# Altium schematic sheet PSU.SchDoc: Project Title
size A3; ApprovedBy: Yves Chevallier; CheckedBy: Yves Chevallier; Author: Yves Chevallier; CompanyName: EPFL; DrawnBy: Yves Chevallier; Engineer: Yves Chevallier; Organization: EPFL; Address1: EPFL; Address2: CH1015 Lausanne; Address3: +41(0)21 693 36 98; Address4: +41(0)21 693 26 00; DocumentNumber: ABC.00.0000.000.0; Revision: v1.0; SheetNumber: 0; SheetTotal: 0; DrawnByDate: 2000-01-01; ExecutionWarrantDate: 2000-01-01; ExecutionWarrant: Yves Chevallier; Context: Confidential; PageSetup: Record=PageOptions|CenterHorizontal=True|CenterVertical=False|PrintScale=0.97|XCorrection=1.00|YCorrection=1.00|PrintKind=0|BorderSize=5000000|LeftOffset=0|BottomOffset=0|Orientation=2|PaperLength=1000|PaperWidth=1000|Scale=100|PaperSource=262|PrintQuality=600|MediaType=1|DitherType=10|PaperKind=A4|PrintScaleMode=1; EngineerDate: 2000-01-01; CheckedByDate: 2000-01-01; ProjectName: PRJ
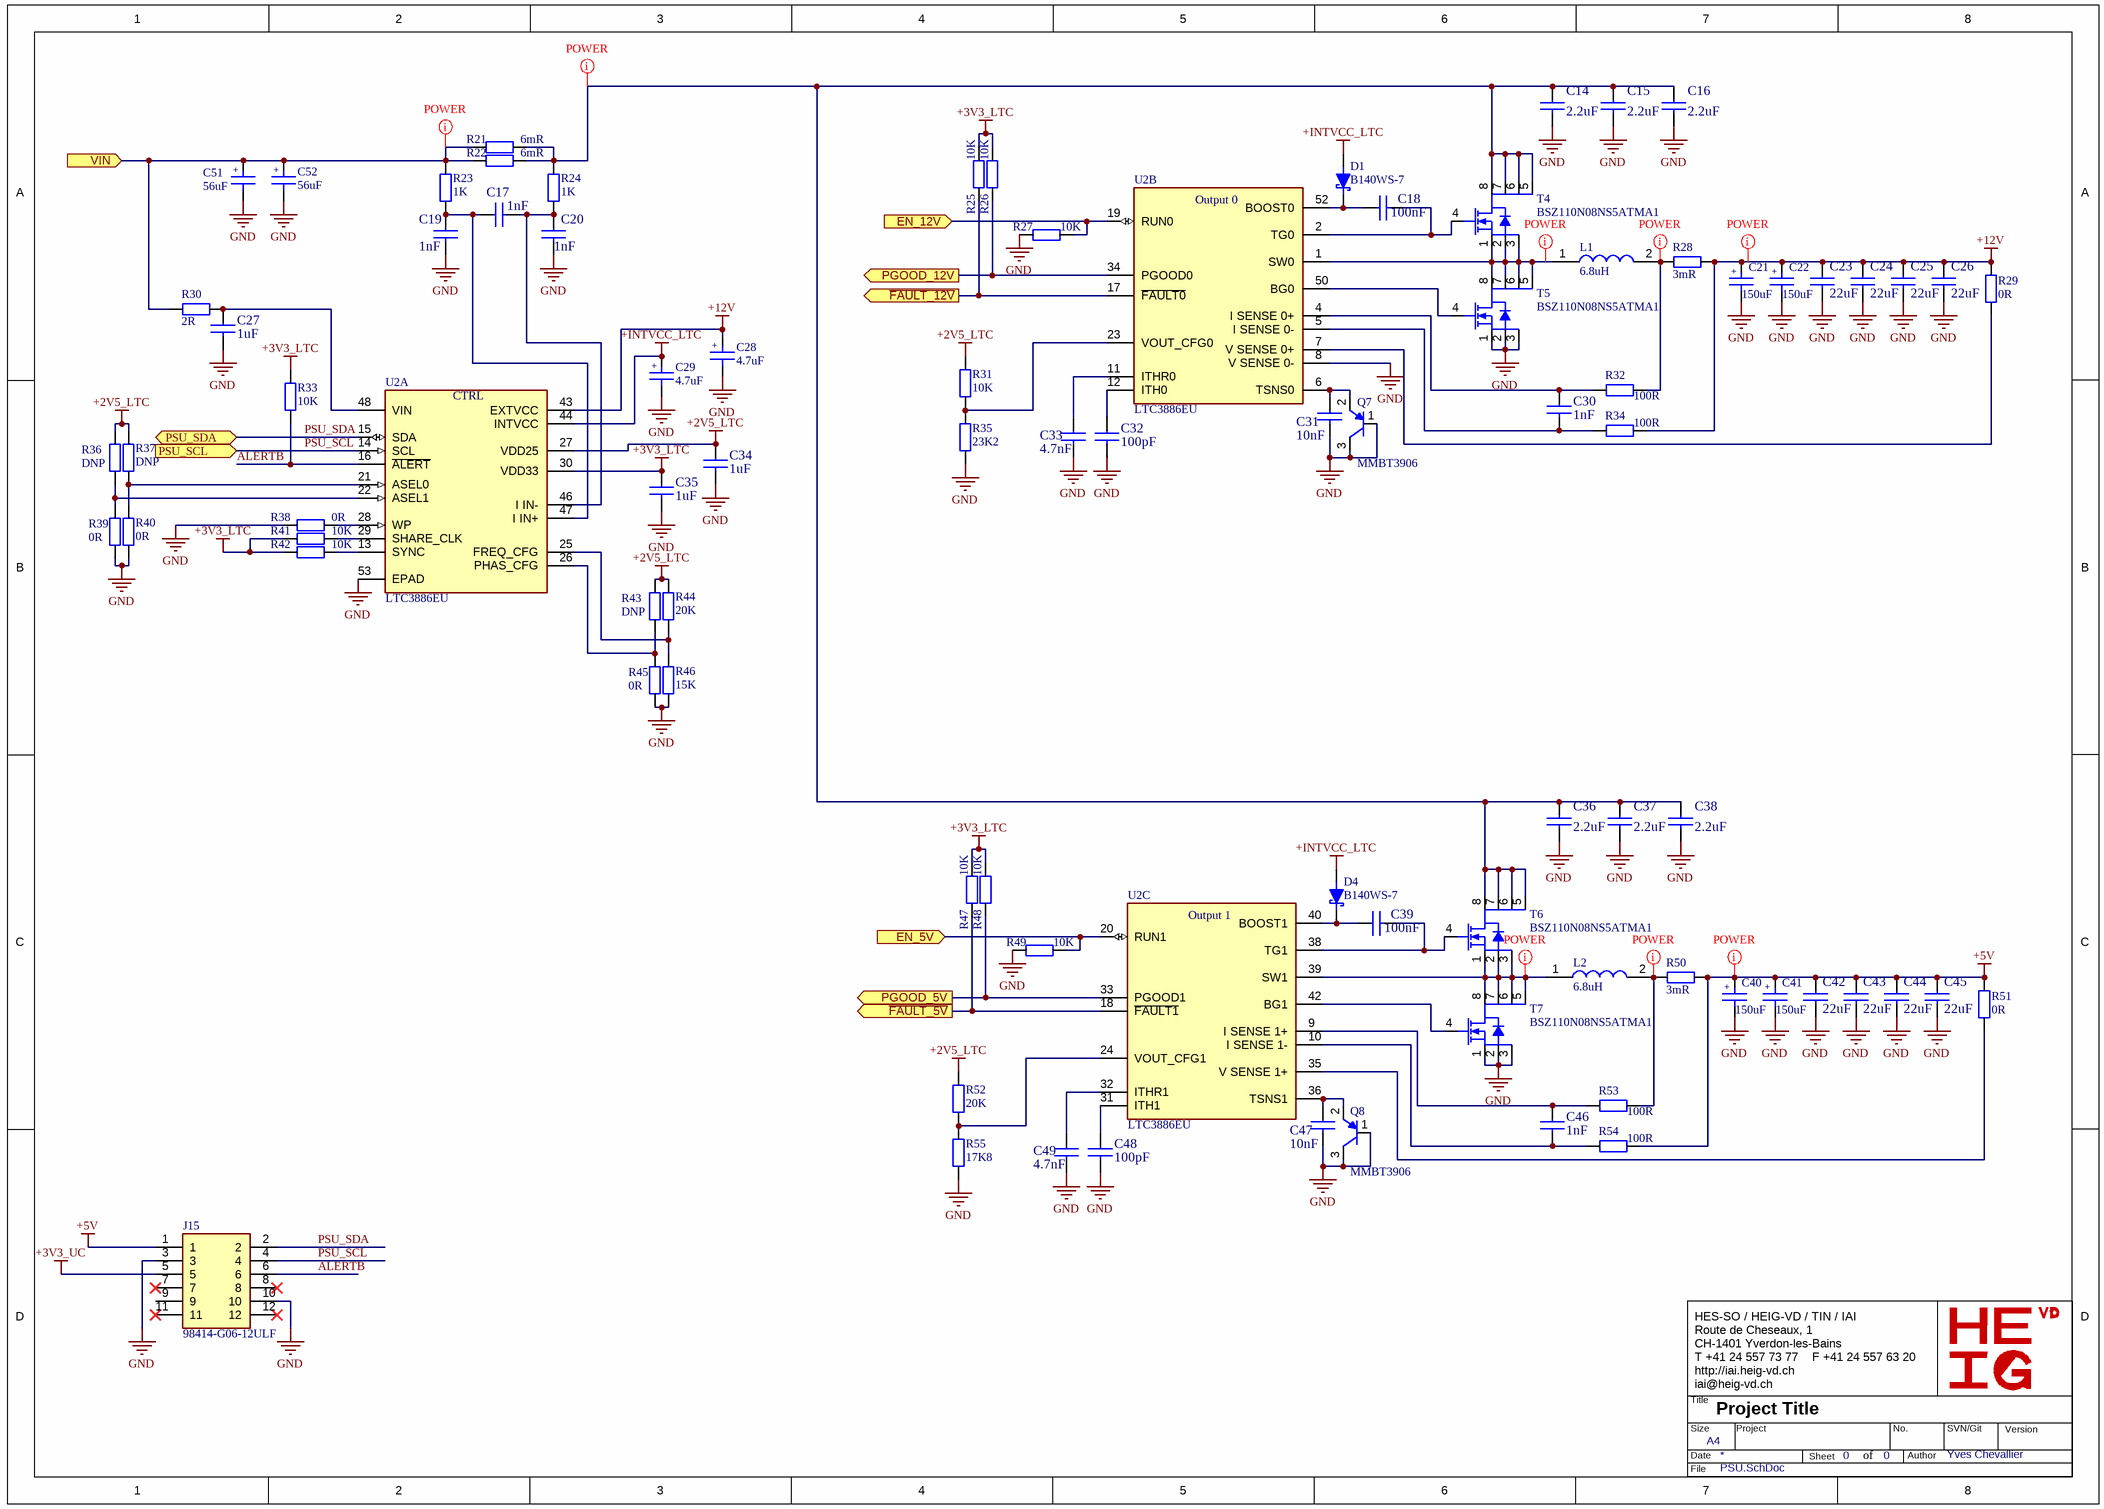
[diagram p0: PSU.SchDoc]

## Parts
C14  2.2uF  [SM/C_0805]
C15  2.2uF  [SM/C_0805]
C16  2.2uF  [SM/C_0805]
C17  1nF  [SM/C_0603]
C18  100nF  [SM/C_0603]
C19  1nF  [SM/C_0603]
C20  1nF  [SM/C_0603]
C21  150uF  [SM/CT_7343_12_D]
C22  150uF  [SM/CT_7343_12_D]
C23  22uF  [SM/C_1210]
C24  22uF  [SM/C_1210]
C25  22uF  [SM/C_1210]
C26  22uF  [SM/C_1210]
C27  1uF  [SM/C_0805]
C28  4.7uF  [T_CAPMP3216X180N]
C29  4.7uF  [T_CAPMP3216X180N]
C30  1nF  [SM/C_0603]
C31  10nF  [SM/C_0603]
C32  100pF  [SM/C_0603]
C33  4.7nF  [SM/C_0603]
C34  1uF  [SM/C_0603]
C35  1uF  [SM/C_0603]
C36  2.2uF  [SM/C_0805]
C37  2.2uF  [SM/C_0805]
C38  2.2uF  [SM/C_0805]
C39  100nF  [SM/C_0603]
C40  150uF  [SM/CT_7343_12_D]
C41  150uF  [SM/CT_7343_12_D]
C42  22uF  [SM/C_1210]
C43  22uF  [SM/C_1210]
C44  22uF  [SM/C_1210]
C45  22uF  [SM/C_1210]
C46  1nF  [SM/C_0603]
C47  10nF  [SM/C_0603]
C48  100pF  [SM/C_0603]
C49  4.7nF  [SM/C_0603]
C51  56uF  [SM/C SIZE F12]
C52  56uF  [SM/C SIZE F12]
D1  B140WS-7  [SM/D_SOD323_A1C2 (SC-76)]
D4  B140WS-7  [SM/D_SOD323_A1C2 (SC-76)]
J15  98414-G06-12ULF  [98414G0612ULF]
L1  6.8uH  [WE-HCI_189023]
L2  6.8uH  [WE-HCI_189023]
Q7  MMBT3906  [SOT23]
Q8  MMBT3906  [SOT23]
R21  6mR  [SM/R_2512]
R22  6mR  [SM/R_2512]
R23  1K  [SM/R_0603]
R24  1K  [SM/R_0603]
R25  10K  [SM/R_0603]
R26  10K  [SM/R_0603]
R27  10K  [SM/R_0603]
R28  3mR  [SM/R_1210]
R29  0R  [SM/R_0603]
R30  2R  [SM/R_0603]
R31  10K  [SM/R_0603]
R32  100R  [SM/R_0603]
R33  10K  [SM/R_0603]
R34  100R  [SM/R_0603]
R35  23K2  [SM/R_0603]
R36  DNP  [SM/R_0603]  (no BOM)
R37  DNP  [SM/R_0603]  (no BOM)
R38  0R  [SM/R_0603]
R39  0R  [SM/R_0603]
R40  0R  [SM/R_0603]
R41  10K  [SM/R_0603]
R42  10K  [SM/R_0603]
R43  DNP  [SM/R_0603]  (no BOM)
R44  20K  [SM/R_0603]
R45  0R  [SM/R_0603]
R46  15K  [SM/R_0603]
R47  10K  [SM/R_0603]
R48  10K  [SM/R_0603]
R49  10K  [SM/R_0603]
R50  3mR  [SM/R_1210]
R51  0R  [SM/R_0603]
R52  20K  [SM/R_0603]
R53  100R  [SM/R_0603]
R54  100R  [SM/R_0603]
R55  17K8  [SM/R_0603]
T4  BSZ110N08NS5ATMA1  [BSZ110N08NS5ATMA1]
T5  BSZ110N08NS5ATMA1  [BSZ110N08NS5ATMA1]
T6  BSZ110N08NS5ATMA1  [BSZ110N08NS5ATMA1]
T7  BSZ110N08NS5ATMA1  [BSZ110N08NS5ATMA1]
U2  LTC3886EU  [UKG_52_ADI]  (parts A,B,C of 3)

## Ports
EN_5V (in), EN_12V (in), PGOOD_5V (out), PGOOD_12V (out), PSU_SCL (in), PSU_SDA (bidir), VIN (in), ~{FAULT_5V} (out), ~{FAULT_12V} (out)

## Nets
+2V5_LTC: C34.1 R31.2 R36.2 R37.2 R43.2 R44.1 R52.1 U2.27(VDD25)
+3V3_LTC: C35.1 R25.1 R26.1 R33.2 R41.1 R42.1 R47.1 R48.1 U2.30(VDD33)
+3V3_UC: J15.5
+5V: C40.1 C41.1 C42.1 C43.1 C44.1 C45.1 J15.1 R50.2 R51.2 R54.2
+12V: C21.1 C22.1 C23.1 C24.1 C25.1 C26.1 C28.1 R28.2 R29.2 R34.2 U2.43(EXTVCC)
+INTVCC_LTC: C29.1 D1.1(A) D4.1(A) U2.44(INTVCC)
GND: C14.2 C15.2 C16.2 C19.2 C20.2 C21.2 C22.2 C23.2 C24.2 C25.2 C26.2 C27.2 C28.2 C29.2 C31.2 C32.2 C33.2 C34.2 C35.2 C36.2 C37.2 C38.2 C40.2 C41.2 C42.2 C43.2 C44.2 C45.2 C47.2 C48.2 C49.2 C51.2 C52.2 J15.3 J15.10 Q7.1(B) Q7.3(C) Q8.1(B) Q8.3(C) R27.2 R35.2 R38.2 R39.1 R40.1 R45.1 R46.2 R49.2 R55.2 T5.1(S) T5.2(S) T5.3(S) T7.1(S) T7.2(S) T7.3(S) U2.8(V_SENSE_0-) U2.53(EPAD)
~{FAULT_5V}: R47.2 U2.18(~{FAULT1}) ; port ~{FAULT_5V}
~{FAULT_12V}: R25.2 U2.17(~{FAULT0}) ; port ~{FAULT_12V}
ALERTB: J15.6 R33.1 U2.16(~{ALERT})
EN_5V: R49.1 U2.20(RUN1) ; port EN_5V
EN_12V: R27.1 U2.19(RUN0) ; port EN_12V
PGOOD_5V: R48.2 U2.33(PGOOD1) ; port PGOOD_5V
PGOOD_12V: R26.2 U2.34(PGOOD0) ; port PGOOD_12V
PSU_SCL: J15.4 U2.14(SCL) ; port PSU_SCL
PSU_SDA: J15.2 U2.15(SDA) ; port PSU_SDA
VIN: C51.1 C52.1 R21.1 R22.1 R23.1 R30.1 ; port VIN
NetC14_1: C14.1 C15.1 C16.1 C36.1 C37.1 C38.1 R21.2 R22.2 R24.1 T4.5(D) T4.6(D) T4.7(D) T4.8(D) T6.5(D) T6.6(D) T6.7(D) T6.8(D)
NetC17_1: C17.1 C19.1 R23.2 U2.47(I_IN+)
NetC17_2: C17.2 C20.1 R24.2 U2.46(I_IN-)
NetC18_1: C18.1 D1.2(C) U2.52(BOOST0)
NetC18_2: C18.2 T4.4(G) U2.2(TG0)
NetC27_1: C27.1 R30.2 U2.48(VIN)
NetC30_1: C30.1 R32.1 U2.4(I_SENSE_0+)
NetC30_2: C30.2 R34.1 U2.5(I_SENSE_0-)
NetC31_1: C31.1 Q7.2(E) U2.6(TSNS0)
NetC32_1: C32.1 U2.12(ITH0)
NetC33_1: C33.1 U2.11(ITHR0)
NetC39_1: C39.1 D4.2(C) U2.40(BOOST1)
NetC39_2: C39.2 T6.4(G) U2.38(TG1)
NetC46_1: C46.1 R53.1 U2.9(I_SENSE_1+)
NetC46_2: C46.2 R54.1 U2.10(I_SENSE_1-)
NetC47_1: C47.1 Q8.2(E) U2.36(TSNS1)
NetC48_1: C48.1 U2.31(ITH1)
NetC49_1: C49.1 U2.32(ITHR1)
NetL1_1: L1.1 T4.1(S) T4.2(S) T4.3(S) T5.5(D) T5.6(D) T5.7(D) T5.8(D) U2.1(SW0)
NetL1_2: L1.2 R28.1 R32.2
NetL2_1: L2.1 T6.1(S) T6.2(S) T6.3(S) T7.5(D) T7.6(D) T7.7(D) T7.8(D) U2.39(SW1)
NetL2_2: L2.2 R50.1 R53.2
NetR29_1: R29.1 U2.7(V_SENSE_0+)
NetR31_1: R31.1 R35.1 U2.23(VOUT_CFG0)
NetR36_1: R36.1 R39.2 U2.22(ASEL1)
NetR37_1: R37.1 R40.2 U2.21(ASEL0)
NetR38_1: R38.1 U2.28(WP)
NetR41_2: R41.2 U2.29(SHARE_CLK)
NetR42_2: R42.2 U2.13(SYNC)
NetR43_1: R43.1 R45.2 U2.26(PHAS_CFG)
NetR44_2: R44.2 R46.1 U2.25(FREQ_CFG)
NetR51_1: R51.1 U2.35(V_SENSE_1+)
NetR52_2: R52.2 R55.1 U2.24(VOUT_CFG1)
NetT5_4: T5.4(G) U2.50(BG0)
NetT7_4: T7.4(G) U2.42(BG1)

Not connected (* = marked no-connect by the designer): J15 7* 8* 9 11* 12*

## Layout directives
net class POWER_CLASS: +5V, +12V, NetC14_1, NetL1_1, NetL1_2, NetL2_1, NetL2_2, VIN

## Notes on the sheet
- HES-SO / HEIG-VD / TIN / IAI
  Route de Cheseaux, 1
  CH-1401 Yverdon-les-Bains
  T +41 24 557 73 77    F +41 24 557 63 20
  http://iai.heig-vd.ch
  iai@heig-vd.ch
- Title
- Size
- Date
- A4
- Project
- Sheet
- of
- No.
- Author
- SVN/Git
- Version
- File
- (in symbol C-TA-4.7uF-10V-20%-3216) +
- (in symbol CAP TANT 150UF 20% 25V 2924) +
- (in symbol HYBRID POLYMER, SMD, 63V, 56UF,) +
- (in symbol IC REG CTRLR BUCK PMBUS 52QFN, part A) CTRL
- (in symbol IC REG CTRLR BUCK PMBUS 52QFN, part B) Output 0
- (in symbol IC REG CTRLR BUCK PMBUS 52QFN, part C) Output 1

## Library data of the parts
C14-C16 C36-C38 = CAP CER 2.2UF 25V X5R 0805: Manufacturer: Samsung; Manufacturer P/N: CL21A225KAFNNNE; Tolerance: 10%; Supplier 1: Digikey; Supplier Part Number 2: 187-CL21A225KAFNNNE; Supplier 2: Mouser; Supplier Part Number 1: 1276-1763-1-ND; Value: 2.2uF; Voltage: 25V; Dielectric: X5R
C17 C19 C20 C30 C46 = CAP CER 1NF 50V X7R 0603: Manufacturer: Samsung; Manufacturer P/N: CL10B102KB8WPJC; Tolerance: 10%; Supplier 1: Digikey; Supplier Part Number 2: 187-CL10B102KB8WPJC; Supplier 2: Mouser; Supplier Part Number 1: 1276-CL10B102KB8WPJCCT-ND; Value: 1nF; Voltage: 50V; Dielectric: X7R; ComponentLink1Description: Supplier; ComponentLink1URL: https://www.digikey.ch/product-detail/fr/samsung-electro-mechanics/CL10B102KB8WPJC/1276-CL10B102KB8WPJCCT-ND/11487951; ComponentLink2Description: Datasheet; ComponentLink2URL: https://www.mouser.ch/datasheet/2/585/MLCC_Automotive-1837966.pdf
C18 C39 = CAP CER 0.1UF 50V X7R 0603: Manufacturer: Samsung; Manufacturer P/N: CL10B104KB8NNNL; Tolerance: 10%; Supplier 1: Digikey; Supplier Part Number 2: 187-CL10B104KB8NNNL; Supplier 2: Mouser; Supplier Part Number 1: 1276-CL10B104KB8NNNLCT-ND; Value: 100nF; Voltage: 50V; Dielectric: X7R
C21 C22 C40 C41 = CAP TANT 150UF 20% 25V 2924: Manufacturer: AVX; Manufacturer P/N: TAJV157M025RNJ; Type: TA; Tolerance: 20%; Supplier 1: Digikey; Supplier 2: Mouser; Supplier Part Number 1: 478-13134-1-ND; Supplier Part Number 2: 581-TAJV157M025RNJ; Value: 150uF; Rating: 25V
C23-C26 C42-C45 = CAP CER 22UF 25V X5R 1210: Manufacturer: Samsung; Manufacturer P/N: CL32A226KAJNNWE; Tolerance: 10%; Supplier 1: Digikey; Supplier Part Number 2: 187-CL32A226KAJNNWE; Supplier 2: Mouser; Supplier Part Number 1: 1276-3369-1-ND; Voltage: 25V; Dielectric: X5R; ComponentLink1Description: Supplier; ComponentLink1URL: https://www.digikey.ch/product-detail/fr/samsung-electro-mechanics/CL32A226KAJNNWE/1276-3369-1-ND/3891455; ComponentLink2Description: Datasheet; ComponentLink2URL: https://www.mouser.ch/datasheet/2/585/MLCC-1837944.pdf; Value: 22uF
C27 = CAP CER 1UF 25V X7R 0805: Manufacturer: Yageo; Manufacturer P/N: CC0805KKX7R8BB105; Tolerance: 10%; Supplier 1: Digikey; Supplier Part Number 2: 603-CC805KKX7R8BB105; Supplier 2: Mouser; Supplier Part Number 1: 311-1456-1-ND; Value: 1uF; Voltage: 25V; Dielectric: X7R
C28 C29 = C-TA-4.7uF-10V-20%-3216: Capacitor TA 4.7uF 10V 20% 3216; Manufacturer: Kemet; Manufacturer P/N: T491A475M010AT; Tolerance: 20%; Type: TA; Supplier 1: Digikey; Supplier 2: Mouser; Supplier Part Number 1: 399-3698-1-ND; Supplier Part Number 2: 80-T491A475M010; Value: 4.7uF; Rating: 10V
C31 C47 = CAP CER 10NF 50V X7R 0603: Manufacturer: Samsung; Manufacturer P/N: CL10B103KB8WPJC; Tolerance: 10%; Supplier 1: Digikey; Supplier Part Number 2: 187-CL10B103KB8WPJC; Supplier 2: Mouser; Supplier Part Number 1: 1276-CL10B103KB8WPJCCT-ND; Value: 10nF; Voltage: 50V; Dielectric: X7R
C32 C48 = CAP CER 100PF 50V C0G/NP0 0603: Manufacturer: Samsung; Manufacturer P/N: CL10C101JB8NNNC; Tolerance: 5%; Supplier 1: Digikey; Supplier Part Number 2: 187-CL10C101JB8NNNC; Supplier 2: Mouser; Supplier Part Number 1: 1276-1008-1-ND; Value: 100pF; Voltage: 50V; Dielectric: C0G/NP0
C33 C49 = CAP CER 4700PF 50V X7R 0603: Manufacturer: Kemet; Manufacturer P/N: C0603C472K5RAC7411; Tolerance: 10%; Supplier 1: Digikey; Supplier Part Number 2: 80-C0603C472K5RLR; Supplier 2: Mouser; Supplier Part Number 1: 399-C0603C472K5RAC7411CT-ND; Value: 4.7nF; Voltage: 50V; Dielectric: X7R
C34 C35 = CAP CER 1UF 10V X7R 0603: Manufacturer: Samsung; Manufacturer P/N: CL10B105KP8NNNC; Tolerance: 10%; Supplier 1: Digikey; Supplier Part Number 2: 187-CL10B105KP8NNNC; Supplier 2: Mouser; Supplier Part Number 1: 1276-1946-1-ND; Value: 1uF; Voltage: 10V; Dielectric: X7R
C51 C52 = HYBRID POLYMER, SMD, 63V, 56UF,: Manufacturer: Kemet; Manufacturer P/N: A780MS566M1JLAS030; Tolerance: 20%; Type: Hybride; Supplier 1: Digikey; Supplier 2: Mouser; Supplier Part Number 1: 399-A780MS566M1JLAS030CT-ND; Supplier Part Number 2: 80-A780MS566M1JLAS30; Value: 56uF; Rating: 63V; ComponentLink1Description: Supplier; ComponentLink1URL: https://www.digikey.ch/product-detail/fr/kemet/A780MS566M1JLAS030/399-A780MS566M1JLAS030CT-ND/13404741; ComponentLink2Description: Datasheet; ComponentLink2URL: https://content.kemet.com/datasheets/KEM_A4098_A780.pdf
D1 D4 = DIODE SCHOTTKY 40V 1A SOD323: Manufacturer: Diodes Incorporated; Value: B140WS-7; Manufacturer P/N: B140WS-7; Supplier 1: Digikey; Supplier 2: Mouser; Supplier Part Number 1: B140WS-7DICT-ND; Supplier Part Number 2: 621-B140WS-7; ComponentLink1Description: Supplier; ComponentLink1URL: https://www.digikey.fr/product-detail/fr/diodes-incorporated/B140WS-7/B140WS-7DICT-ND/5218269; ComponentLink2Description: Datasheet; ComponentLink2URL: https://www.diodes.com/assets/Datasheets/ds31543.pdf
J15 = CONN HEADER VERT 12POS 2MM: Manufacturer: Amphenol; Manufacturer P/N: 98414-G06-12ULF; Supplier 1: Digikey; Supplier 2: Mouser; Supplier Part Number 1: 609-3106-ND; Supplier Part Number 2: 649-98414-G06-12ULF; Value: 98414-G06-12ULF
L1 L2 = FIXED IND 6.8UH 18.5A 4.1MOHM SM: Manufacturer: Wurth Elektronik; Manufacturer P/N: 7443556680; Supplier 1: Digikey; Supplier Part Number 1: 732-2174-1-ND; Supplier 2: Mouser; Supplier Part Number 2: 710-7443556680; Value: 6.8uH
Q7 Q8 = TRANSISTOR, PNP, -40V, -0.2A, 10: Manufacturer: Taiwan Semiconductor; Manufacturer P/N: MMBT3906 RFG; Supplier 1: Digikey; Supplier Part Number 1: MMBT3906RFGCT-ND; Supplier 2: Mouser; Supplier Part Number 2: 821-MMBT3906RFG; Value: MMBT3906
R21 R22 = METAL CURRENT SENSOR 2512 1% 100: Manufacturer: Yageo; Manufacturer P/N: PA2512FKF7W0R006E; Power: 2W; Voltage: 75V; Value: 6mR; Tolerance: 1%; Supplier 1: Digikey; Supplier Part Number 1: YAG6098CT-ND; Supplier 2: Mouser; Supplier Part Number 2: 603-PA2512FKF7WR006E
R23 R24 = RES SMD 1K OHM 1% 1/10W 0603: Manufacturer: Yageo; Manufacturer P/N: RC0603FR-071KL; Power: 100mW; Voltage: 75V; Value: 1K; Tolerance: 1%; Supplier 1: Digikey; Supplier Part Number 1: 311-1.00KHRCT-ND; ComponentLink1Description: Datasheet; ComponentLink1URL: https://www.yageo.com/upload/media/product/productsearch/datasheet/rchip/PYu-RC_Group_51_RoHS_L_11.pdf; ComponentLink2Description: Supplier; ComponentLink2URL: https://www.digikey.ch/product-detail/fr/yageo/RC0603FR-071KL/311-1-00KHRCT-ND/729790; Supplier 2: Mouser; Supplier Part Number 2: 603-RC0603FR-071KL
R25-R27 R31 R33 R41 R42 R47-R49 = RES SMD 10K OHM 1% 1/10W 0603: Résistance 0603 100mW 1% 10K; Manufacturer: Yageo; Manufacturer P/N: RC0603FR-0710KL; Voltage: 75V; Value: 10K; Power: 100mW; Tolerance: 1%; Supplier 1: Digikey; Supplier Part Number 1: 311-10.0KHRCT-ND; ComponentLink1Description: Datasheet; ComponentLink1URL: https://www.yageo.com/upload/media/product/productsearch/datasheet/rchip/PYu-RC_Group_51_RoHS_L_11.pdf; ComponentLink2Description: Supplier; ComponentLink2URL: https://www.digikey.ch/product-detail/fr/yageo/RC0603FR-0710KL/311-10-0KHRCT-ND/729827; Supplier 2: Mouser; Supplier Part Number 2: 603-RC0603FR-0710KL
R28 R50 = RES 0.003 OHM 5% 1W 1210: Manufacturer: Rohm; Manufacturer P/N: PMR25HZPJV3L0; Voltage: 75V; Value: 3mR; Power: 1W; Tolerance: 5%; Supplier 1: Digikey; Supplier Part Number 1: RHM.003AQCT-ND; Supplier 2: Mouser; Supplier Part Number 2: 755-PMR25HZPJV3L0
R29 R38-R40 R45 R51 = RES SMD 0 OHM JUMPER 1/10W 0603: Manufacturer: Yageo; Manufacturer P/N: RC0603FR-070RL; Power: 100mW; Voltage: 75V; Tolerance: 1%; Value: 0R; Supplier 1: Digikey; Supplier Part Number 1: 311-0.0HRCT-ND; ComponentLink1Description: Datasheet; ComponentLink1URL: https://www.yageo.com/upload/media/product/productsearch/datasheet/rchip/PYu-RC_Group_51_RoHS_L_11.pdf; ComponentLink2Description: Supplier; ComponentLink2URL: https://www.digikey.ch/product-detail/fr/yageo/RC0603FR-070RL/311-0-0HRCT-ND/4340584; Supplier 2: Mouser; Supplier Part Number 2: 603-RC0603FR-070RL
R30 = RES 2 OHM 1% 1/10W 0603: Manufacturer: Yageo; Manufacturer P/N: RC0603FR-072RL; Power: 100mW; Voltage: 75V; Value: 2R; Tolerance: 1%; Supplier 1: Digikey; Supplier Part Number 1: 311-2.00HRCT-ND; Supplier 2: Mouser; Supplier Part Number 2: 603-RC0603FR-072RL
R32 R34 R53 R54 = RES 100 OHM 1% 1/10W 0603: Manufacturer: Yageo; Manufacturer P/N: RC0603FR-07100RL; Power: 100mW; Voltage: 75V; Value: 100R; Tolerance: 1%; Supplier 1: Digikey; Supplier Part Number 1: 311-100HRCT-ND; Supplier 2: Mouser; Supplier Part Number 2: 603-RC0603FR-07100RL
R35 = RES 23.2K OHM 1% 1/10W 0603: Manufacturer: Yageo; Manufacturer P/N: RC0603FR-0723K2L; Power: 100mW; Voltage: 75V; Value: 23K2; Tolerance: 1%; Supplier 1: Digikey; Supplier Part Number 1: 311-23.2KHRCT-ND; Supplier 2: Mouser; Supplier Part Number 2: 03-RC0603FR-0723K2L
R36 R37 R43 = RES SMD DNP JUMPER 1/10W 0603: Value: DNP; ComponentLink1Description: Datasheet; ComponentLink2Description: Supplier
R44 R52 = RES 20K OHM 1% 1/10W 0603: Manufacturer: Yageo; Manufacturer P/N: RC0603FR-0720KL; Power: 100mW; Voltage: 75V; Value: 20K; Tolerance: 1%; Supplier 1: Digikey; Supplier Part Number 1: 311-20.0KHRCT-ND; Supplier 2: Mouser; Supplier Part Number 2: 603-RC0603FR-0720KL
R46 = RES 15K OHM 1% 1/10W 0603: Manufacturer: Yageo; Manufacturer P/N: RC0603FR-1315KL; Power: 100mW; Voltage: 75V; Value: 15K; Tolerance: 1%; Supplier 1: Digikey; Supplier Part Number 1: 13-RC0603FR-1315KLCT-ND; Supplier 2: Mouser; Supplier Part Number 2: 603-RC0603FR-1315KL
R55 = RES 17.8K OHM 1% 1/10W 0603: Manufacturer: Yageo; Manufacturer P/N: RC0603FR-0717K8L; Power: 100mW; Voltage: 75V; Value: 17K8; Tolerance: 1%; Supplier 1: Digikey; Supplier Part Number 1: 311-17.8KHRCT-ND; Supplier 2: Mouser; Supplier Part Number 2: 603-RC0603FR-0717K8L
T4-T7 = MOSFET N-CH 80V 40A TSDSON: Manufacturer Name: Infineon; Supplier 1: Digikey; Supplier 2: Mouser; Supplier Part Number 1: BSZ110N08NS5ATMA1CT-ND; Supplier Part Number 2: 726-BSZ110N08NS5ATMA; Value: BSZ110N08NS5ATMA1; Manufacturer P/N: BSZ110N08NS5ATMA1
U2 = IC REG CTRLR BUCK PMBUS 52QFN: Manufacturer: Analog Devices; Manufacturer P/N: LTC3886EUKG#PBF; Value: LTC3886EU; Supplier 1: Digikey; Supplier 2: Mouser; Supplier Part Number 1: LTC3886EUKG#PBF-ND; Supplier Part Number 2: 584-LTC3886EUKG#PBF